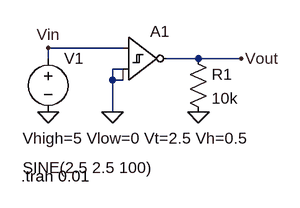
[diagram p0: schematic Schmitt Trigger Circuit.asc]
Schmitt Trigger Circuit.asc, the LTspice schematic file:
Version 4.1
SHEET 1 880 680
WIRE 192 144 80 144
WIRE 80 160 80 144
WIRE 304 160 256 160
WIRE 368 160 304 160
WIRE 192 176 176 176
WIRE 176 192 176 176
WIRE 192 192 176 192
WIRE 176 240 176 192
FLAG 80 240 0
FLAG 176 240 0
FLAG 304 240 0
FLAG 368 160 Vout
FLAG 80 144 Vin
SYMBOL Digital\\diffschmtinv 192 96 R0
WINDOW 3 -150 183 Left 2
SYMATTR Value Vhigh=5 Vlow=0 Vt=2.5 Vh=0.5
SYMATTR InstName A1
SYMBOL voltage 80 144 R0
WINDOW 3 -38 179 Left 2
WINDOW 123 0 0 Left 0
WINDOW 39 0 0 Left 0
SYMATTR Value SINE(2.5 2.5 100)
SYMATTR InstName V1
SYMBOL res 288 144 R0
SYMATTR InstName R1
SYMATTR Value 10k
TEXT 40 336 Left 2 !.tran 0.01

The netlist it stands for:
* Schmitt Trigger Circuit.asc
A1 Vin 0 0 0 0 Vout 0 0 SCHMITT Vhigh=5 Vlow=0 Vt=2.5 Vh=0.5
V1 Vin 0 SINE(2.5 2.5 100)
R1 Vout 0 10k
.tran 0.01
.backanno
.end